# Altium schematic sheet Volt_meter.SchDoc
size A4
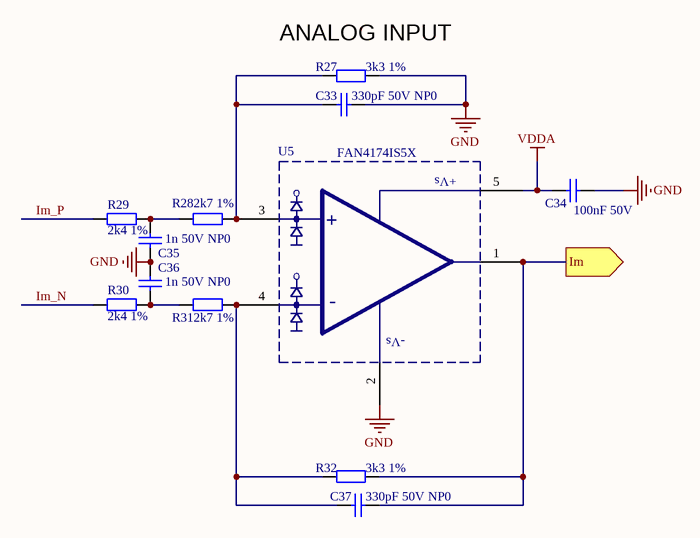
[diagram p0: Volt_meter.SchDoc]

## Parts
C33  330pF 50V NP0  [0805_C]
C34  100nF 50V  [0805_C]
C35  1n 50V NP0  [0805_C]
C36  1n 50V NP0  [0805_C]
C37  330pF 50V NP0  [0805_C]
R27  3k3 1%  [MELF_RES_LARGE]
R28  2k7 1%  [MELF_RES_LARGE]
R29  2k4 1%  [MELF_RES_LARGE]
R30  2k4 1%  [MELF_RES_LARGE]
R31  2k7 1%  [MELF_RES_LARGE]
R32  3k3 1%  [MELF_RES_LARGE]
U5  FAN4174IS5X  [SOT-23-5]

## Ports
Im (out)

## Nets
GND: C33.2 C34.1 C35.1 C36.2 R27.1 U5.2(-Vs)
VDDA: C34.2 U5.5(+Vs)
Im: C37.2 R32.1 U5.1(OUT) ; port Im
Im_N: R30.2
Im_P: R29.2
NetC33_1: C33.1 R27.2 R28.1 U5.3(+IN)
NetC35_2: C35.2 R28.2 R29.1
NetC36_1: C36.1 R30.1 R31.2
NetC37_1: C37.1 R31.1 R32.2 U5.4(-IN)

## Notes on the sheet
- (near R27) ANALOG INPUT
- (in symbol FAN4174IS5X) +; -

## Library data of the parts
C33 C37 = Capacitor_SMD: SMD kondenzátorok; CompType: CC0805JRNP09BN331; Distributor: Lomex; Order Code: 82-01-07; Package: 0805; Part Class: Capacitor; Value: 330pF 50V NP0
C34 = Capacitor_SMD: SMD kondenzátorok; CompType: CC0805KPX7R9BB104; Note: 10% X7R; Distributor: Lomex; Order Code: 82-07-32; Package: 0805; Part Class: Capacitor; Value: 100nF 50V
C35 C36 = Capacitor: CompType: CC0805JRNP09BN102; Distributor: Lomex; Order Code: 82-01-13; Package: 0805; Part Class: Capacitor; Value: 1n 50V NP0
R27 R32 = Resistor: CompType: CR-05FL7---3K3; Distributor: Lomex; Order Code: 80-10-92; Package: 0805; Part Class: Resistor; Value: 3k3 1%
R28 R31 = Resistor: CompType: CR-05FL7---2K7; Distributor: Lomex; Order Code: 80-10-91; Package: 0805; Part Class: Resistor; Value: 2k7 1%
R29 R30 = Resistor: CompType: CR-05FL7---2K4; Distributor: Lomex; Order Code: 80-14-00; Package: 0805; Part Class: Resistor; Value: 2k4 1%
U5 = FAN4174IS5X: OrderCode: 671-1166; CompType: FAN4174IS5X; Distributor: RS components; Package: SOT-23-5